# Altium schematic sheet Input Debouncing.SchDoc
size A4
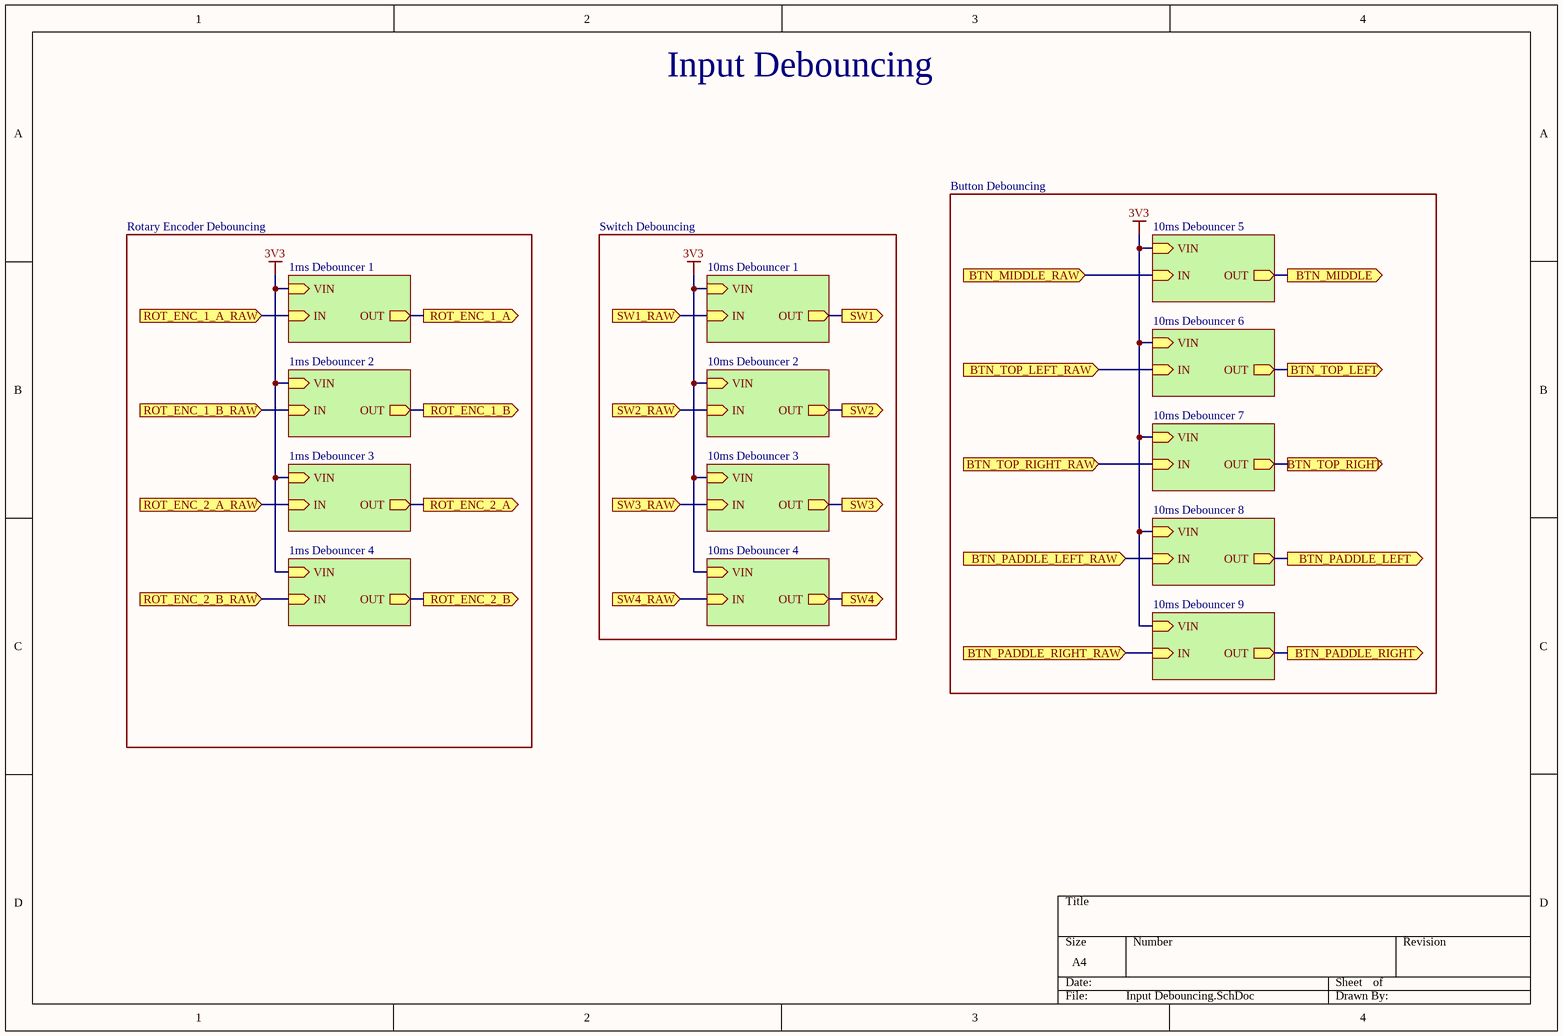
[diagram p0: Input Debouncing.SchDoc]

## Sub-sheets
1ms Debouncer 1 = 1ms Debouncer: VIN (in), IN (in), OUT (out)
1ms Debouncer 2 = 1ms Debouncer: VIN (in), IN (in), OUT (out)
1ms Debouncer 3 = 1ms Debouncer: VIN (in), IN (in), OUT (out)
1ms Debouncer 4 = 1ms Debouncer: VIN (in), IN (in), OUT (out)
10ms Debouncer 1 = 10ms Debouncer: VIN (in), IN (in), OUT (out)
10ms Debouncer 2 = 10ms Debouncer: VIN (in), IN (in), OUT (out)
10ms Debouncer 3 = 10ms Debouncer: VIN (in), IN (in), OUT (out)
10ms Debouncer 4 = 10ms Debouncer: VIN (in), IN (in), OUT (out)
10ms Debouncer 5 = 10ms Debouncer: VIN (in), IN (in), OUT (out)
10ms Debouncer 6 = 10ms Debouncer: VIN (in), IN (in), OUT (out)
10ms Debouncer 7 = 10ms Debouncer: VIN (in), IN (in), OUT (out)
10ms Debouncer 8 = 10ms Debouncer: VIN (in), IN (in), OUT (out)
10ms Debouncer 9 = 10ms Debouncer: VIN (in), IN (in), OUT (out)

## Ports
BTN_MIDDLE (out), BTN_MIDDLE_RAW (in), BTN_PADDLE_LEFT (out), BTN_PADDLE_LEFT_RAW (in), BTN_PADDLE_RIGHT (out), BTN_PADDLE_RIGHT_RAW (in), BTN_TOP_LEFT (out), BTN_TOP_LEFT_RAW (in), BTN_TOP_RIGHT (out), BTN_TOP_RIGHT_RAW (in), ROT_ENC_1_A (out), ROT_ENC_1_A_RAW (in), ROT_ENC_1_B (out), ROT_ENC_1_B_RAW (in), ROT_ENC_2_A (out), ROT_ENC_2_A_RAW (in), ROT_ENC_2_B (out), ROT_ENC_2_B_RAW (in), SW1 (out), SW1_RAW (in), SW2 (out), SW2_RAW (in), SW3 (out), SW3_RAW (in), SW4 (out), SW4_RAW (in)

## Nets
3V3: sheet 10ms Debouncer 1/VIN, sheet 10ms Debouncer 2/VIN, sheet 10ms Debouncer 3/VIN, sheet 10ms Debouncer 4/VIN, sheet 10ms Debouncer 5/VIN, sheet 10ms Debouncer 6/VIN, sheet 10ms Debouncer 7/VIN, sheet 10ms Debouncer 8/VIN, sheet 10ms Debouncer 9/VIN, sheet 1ms Debouncer 1/VIN, sheet 1ms Debouncer 2/VIN, sheet 1ms Debouncer 3/VIN, sheet 1ms Debouncer 4/VIN
BTN_MIDDLE: port BTN_MIDDLE, sheet 10ms Debouncer 5/OUT
BTN_MIDDLE_RAW: port BTN_MIDDLE_RAW, sheet 10ms Debouncer 5/IN
BTN_PADDLE_LEFT: port BTN_PADDLE_LEFT, sheet 10ms Debouncer 8/OUT
BTN_PADDLE_LEFT_RAW: port BTN_PADDLE_LEFT_RAW, sheet 10ms Debouncer 8/IN
BTN_PADDLE_RIGHT: port BTN_PADDLE_RIGHT, sheet 10ms Debouncer 9/OUT
BTN_PADDLE_RIGHT_RAW: port BTN_PADDLE_RIGHT_RAW, sheet 10ms Debouncer 9/IN
BTN_TOP_LEFT: port BTN_TOP_LEFT, sheet 10ms Debouncer 6/OUT
BTN_TOP_LEFT_RAW: port BTN_TOP_LEFT_RAW, sheet 10ms Debouncer 6/IN
BTN_TOP_RIGHT: port BTN_TOP_RIGHT, sheet 10ms Debouncer 7/OUT
BTN_TOP_RIGHT_RAW: port BTN_TOP_RIGHT_RAW, sheet 10ms Debouncer 7/IN
ROT_ENC_1_A: port ROT_ENC_1_A, sheet 1ms Debouncer 1/OUT
ROT_ENC_1_A_RAW: port ROT_ENC_1_A_RAW, sheet 1ms Debouncer 1/IN
ROT_ENC_1_B: port ROT_ENC_1_B, sheet 1ms Debouncer 2/OUT
ROT_ENC_1_B_RAW: port ROT_ENC_1_B_RAW, sheet 1ms Debouncer 2/IN
ROT_ENC_2_A: port ROT_ENC_2_A, sheet 1ms Debouncer 3/OUT
ROT_ENC_2_A_RAW: port ROT_ENC_2_A_RAW, sheet 1ms Debouncer 3/IN
ROT_ENC_2_B: port ROT_ENC_2_B, sheet 1ms Debouncer 4/OUT
ROT_ENC_2_B_RAW: port ROT_ENC_2_B_RAW, sheet 1ms Debouncer 4/IN
SW1: port SW1, sheet 10ms Debouncer 1/OUT
SW1_RAW: port SW1_RAW, sheet 10ms Debouncer 1/IN
SW2: port SW2, sheet 10ms Debouncer 2/OUT
SW2_RAW: port SW2_RAW, sheet 10ms Debouncer 2/IN
SW3: port SW3, sheet 10ms Debouncer 3/OUT
SW3_RAW: port SW3_RAW, sheet 10ms Debouncer 3/IN
SW4: port SW4, sheet 10ms Debouncer 4/OUT
SW4_RAW: port SW4_RAW, sheet 10ms Debouncer 4/IN

## Notes on the sheet
- Input Debouncing
- Rotary Encoder Debouncing
- Switch Debouncing
- Button Debouncing